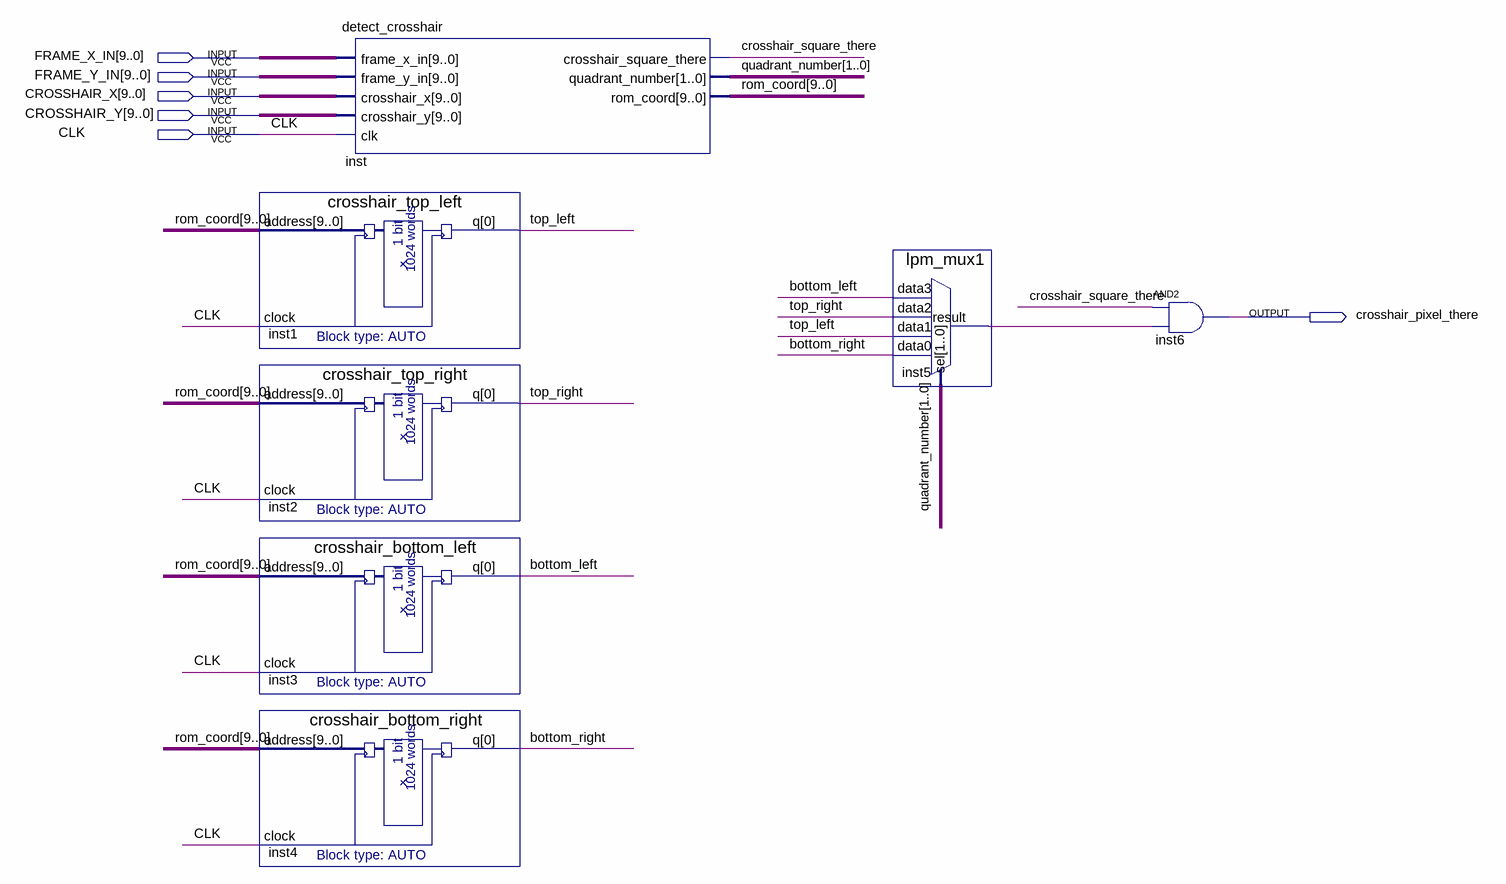
[diagram p0: schematic sheet]
// Quartus schematic crosshair_pixel.bdf as structural Verilog: 7 symbols, 6 pins
module crosshair_pixel (
  input  [9:0] FRAME_X_IN,
  input  [9:0] FRAME_Y_IN,
  input  [9:0] CROSSHAIR_X,
  input  [9:0] CROSSHAIR_Y,
  input  CLK,
  output crosshair_pixel_there
);

  wire bottom_left, bottom_right, crosshair_square_there, inst5_result, top_left, top_right;
  wire [1:0] quadrant_number;
  wire [9:0] rom_coord;

  crosshair_top_left inst1 (.address(rom_coord), .clock(CLK), .q(top_left));
  crosshair_top_right inst2 (.address(rom_coord), .clock(CLK), .q(top_right));
  crosshair_bottom_left inst3 (.address(rom_coord), .clock(CLK), .q(bottom_left));
  crosshair_bottom_right inst4 (.address(rom_coord), .clock(CLK), .q(bottom_right));
  detect_crosshair inst (
    .frame_x_in(FRAME_X_IN), .frame_y_in(FRAME_Y_IN), .crosshair_x(CROSSHAIR_X), .crosshair_y(CROSSHAIR_Y),
    .clk(CLK), .crosshair_square_there(crosshair_square_there), .quadrant_number(quadrant_number),
    .rom_coord(rom_coord));
  lpm_mux1 inst5 (
    .data3(bottom_left), .data2(top_right), .data1(top_left), .data0(bottom_right), .sel(quadrant_number),
    .result(inst5_result));
  and inst6 (crosshair_pixel_there, crosshair_square_there, inst5_result);
endmodule
